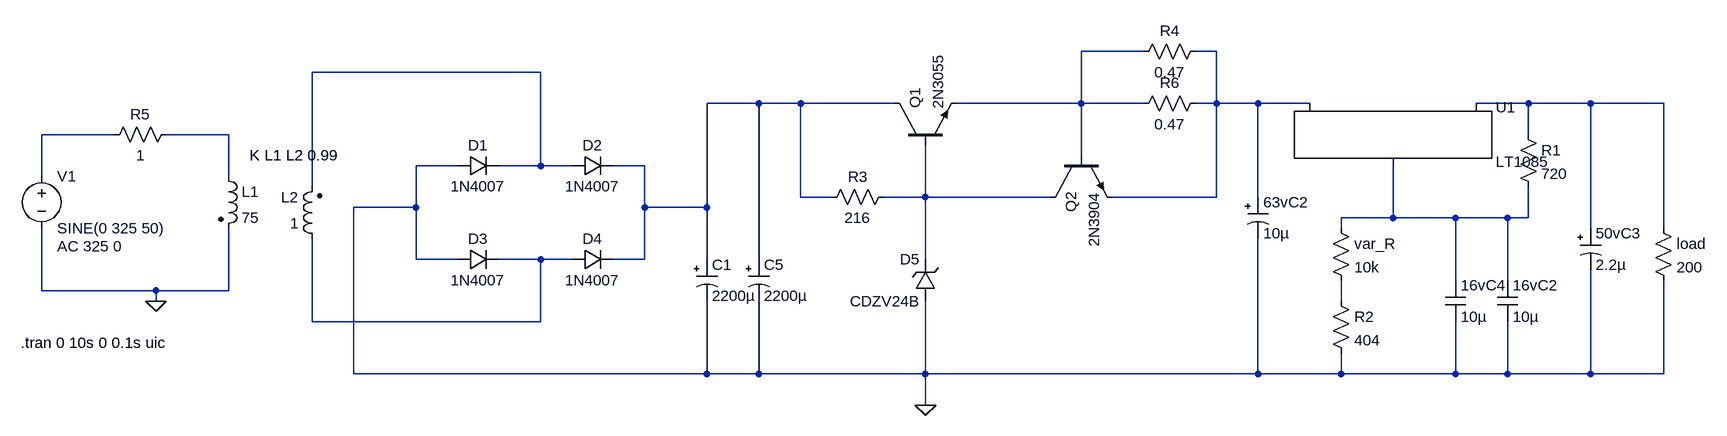
[diagram p0: schematic testing.asc]
testing.asc, the LTspice schematic file:
Version 4
SHEET 1 2948 816
WIRE 1040 -192 944 -192
WIRE 1152 -192 1120 -192
WIRE 112 -160 -240 -160
WIRE 448 -112 368 -112
WIRE 512 -112 448 -112
WIRE 656 -112 512 -112
WIRE 944 -112 944 -192
WIRE 944 -112 752 -112
WIRE 1040 -112 944 -112
WIRE 1152 -112 1152 -192
WIRE 1152 -112 1120 -112
WIRE 1216 -112 1152 -112
WIRE 1296 -112 1216 -112
WIRE 1632 -112 1552 -112
WIRE 1728 -112 1632 -112
WIRE 1840 -112 1728 -112
WIRE -544 -64 -656 -64
WIRE -368 -64 -464 -64
WIRE 1632 -64 1632 -112
WIRE 944 -32 944 -112
WIRE -16 -16 -80 -16
WIRE 112 -16 112 -160
WIRE 112 -16 48 -16
WIRE 160 -16 112 -16
WIRE 272 -16 224 -16
WIRE -656 0 -656 -64
WIRE -368 0 -368 -64
WIRE -240 16 -240 -160
WIRE 512 32 512 -112
WIRE 560 32 512 32
WIRE 704 32 704 -48
WIRE 704 32 640 32
WIRE 896 32 704 32
WIRE 1152 32 1152 -112
WIRE 1152 32 992 32
WIRE 1216 32 1216 -112
WIRE -80 48 -80 -16
WIRE -80 48 -176 48
WIRE 272 48 272 -16
WIRE 368 48 368 -112
WIRE 368 48 272 48
WIRE 1424 64 1424 -16
WIRE 1424 64 1344 64
WIRE 1520 64 1424 64
WIRE 1600 64 1520 64
WIRE 1632 64 1632 16
WIRE 1632 64 1600 64
WIRE 1344 80 1344 64
WIRE 1728 80 1728 -112
WIRE 1840 80 1840 -112
WIRE -80 128 -80 48
WIRE -16 128 -80 128
WIRE 112 128 48 128
WIRE 160 128 112 128
WIRE 272 128 272 48
WIRE 272 128 224 128
WIRE 368 128 368 48
WIRE 448 128 448 -112
WIRE 704 128 704 32
WIRE 1520 160 1520 64
WIRE 1600 160 1600 64
WIRE -656 176 -656 80
WIRE -480 176 -656 176
WIRE -368 176 -368 80
WIRE -368 176 -480 176
WIRE -480 192 -480 176
WIRE 1344 192 1344 160
WIRE -240 224 -240 96
WIRE 112 224 112 128
WIRE 112 224 -240 224
WIRE -176 304 -176 48
WIRE 368 304 368 192
WIRE 368 304 -176 304
WIRE 448 304 448 192
WIRE 448 304 368 304
WIRE 704 304 704 192
WIRE 704 304 448 304
WIRE 1216 304 1216 96
WIRE 1216 304 704 304
WIRE 1344 304 1344 272
WIRE 1344 304 1216 304
WIRE 1520 304 1520 224
WIRE 1520 304 1344 304
WIRE 1600 304 1600 224
WIRE 1600 304 1520 304
WIRE 1728 304 1728 144
WIRE 1728 304 1600 304
WIRE 1840 304 1840 160
WIRE 1840 304 1728 304
WIRE 704 352 704 304
FLAG -480 192 0
FLAG 704 352 0
SYMBOL ind2 -384 -16 R0
SYMATTR InstName L1
SYMATTR Value 75
SYMATTR Type ind
SYMBOL ind2 -224 112 R180
WINDOW 0 36 80 Left 2
WINDOW 3 36 40 Left 2
SYMATTR InstName L2
SYMATTR Value 1
SYMATTR Type ind
SYMBOL voltage -656 -16 R0
WINDOW 123 24 124 Left 2
WINDOW 39 0 0 Left 0
SYMATTR Value2 AC 325 0
SYMATTR InstName V1
SYMATTR Value SINE(0 325 50)
SYMBOL diode -16 0 R270
WINDOW 0 32 32 VTop 2
WINDOW 3 0 32 VBottom 2
SYMATTR InstName D1
SYMATTR Value 1N4007
SYMBOL diode 160 0 R270
WINDOW 0 32 32 VTop 2
WINDOW 3 0 32 VBottom 2
SYMATTR InstName D2
SYMATTR Value 1N4007
SYMBOL diode -16 144 R270
WINDOW 0 32 32 VTop 2
WINDOW 3 0 32 VBottom 2
SYMATTR InstName D3
SYMATTR Value 1N4007
SYMBOL diode 160 144 R270
WINDOW 0 32 32 VTop 2
WINDOW 3 0 32 VBottom 2
SYMATTR InstName D4
SYMATTR Value 1N4007
SYMBOL polcap 352 128 R0
SYMATTR InstName C1
SYMATTR Value 2200µ
SYMBOL PowerProducts\\LT1085 1424 -112 R0
SYMATTR InstName U1
SYMBOL res -448 -80 R90
WINDOW 0 0 56 VBottom 2
WINDOW 3 32 56 VTop 2
SYMATTR InstName R5
SYMATTR Value 1
SYMBOL polcap 1200 32 R0
SYMATTR InstName 63vC2
SYMATTR Value 10µ
SYMBOL polcap 1712 80 R0
SYMATTR InstName 50vC3
SYMATTR Value 2.2µ
SYMBOL res 1616 -80 R0
SYMATTR InstName R1
SYMATTR Value 720
SYMBOL res 1328 64 R0
SYMATTR InstName var_R
SYMATTR Value 10k
SYMBOL res 1824 64 R0
SYMATTR InstName load
SYMATTR Value 200
SYMBOL npn 656 -48 R270
SYMATTR InstName Q1
SYMATTR Value 2N3055
SYMBOL zener 720 192 R180
WINDOW 0 24 64 Left 2
WINDOW 3 24 0 Left 2
SYMATTR InstName D5
SYMATTR Value CDZV24B
SYMATTR Description Diode
SYMATTR Type diode
SYMBOL res 544 48 R270
WINDOW 0 32 56 VTop 2
WINDOW 3 0 56 VBottom 2
SYMATTR InstName R3
SYMATTR Value 216
SYMBOL cap 1504 160 R0
SYMATTR InstName 16vC4
SYMATTR Value 10µ
SYMBOL npn 896 -32 M90
SYMATTR InstName Q2
SYMATTR Value 2N3904
SYMBOL res 1136 -128 R90
WINDOW 0 0 56 VBottom 2
WINDOW 3 32 56 VTop 2
SYMATTR InstName R6
SYMATTR Value 0.47
SYMBOL polcap 432 128 R0
SYMATTR InstName C5
SYMATTR Value 2200µ
SYMBOL res 1328 176 R0
SYMATTR InstName R2
SYMATTR Value 404
SYMBOL res 1136 -208 R90
WINDOW 0 0 56 VBottom 2
WINDOW 3 32 56 VTop 2
SYMATTR InstName R4
SYMATTR Value 0.47
SYMBOL cap 1584 160 R0
SYMATTR InstName 16vC2
SYMATTR Value 10µ
TEXT -688 256 Left 2 !.tran 0 10s 0 0.1s uic
TEXT -336 -32 Left 2 !K L1 L2 0.99

The netlist it stands for:
* testing.asc
L1 N007 0 75
L2 N010 N003 1
V1 N006 0 SINE(0 325 50) AC 325 0
D1 0 N003 1N4007
D2 N003 N004 1N4007
D3 0 N010 1N4007
D4 N010 N004 1N4007
C1 N004 0 2200µ
XU1 N009 N005 N002 LT1085
R5 N007 N006 1
C§63vC2 N002 0 10µ
C§50vC3 N005 0 2.2µ
R1 N005 N009 720
R§var_R N009 N011 10k
R§load N005 0 200
Q1 N004 N008 N001 0 2N3055
D5 0 N008 CDZV24B
R3 N004 N008 216
C§16vC4 N009 0 10µ
Q2 N008 N001 N002 0 2N3904
R6 N002 N001 0.47
C5 N004 0 2200µ
R2 N011 0 404
R4 N002 N001 0.47
C§16vC2 N009 0 10µ
.model D D
.lib standard.dio
.model NPN NPN
.model PNP PNP
.lib standard.bjt
.tran 0 10s 0 0.1s uic
K L1 L2 0.99
.backanno
.end